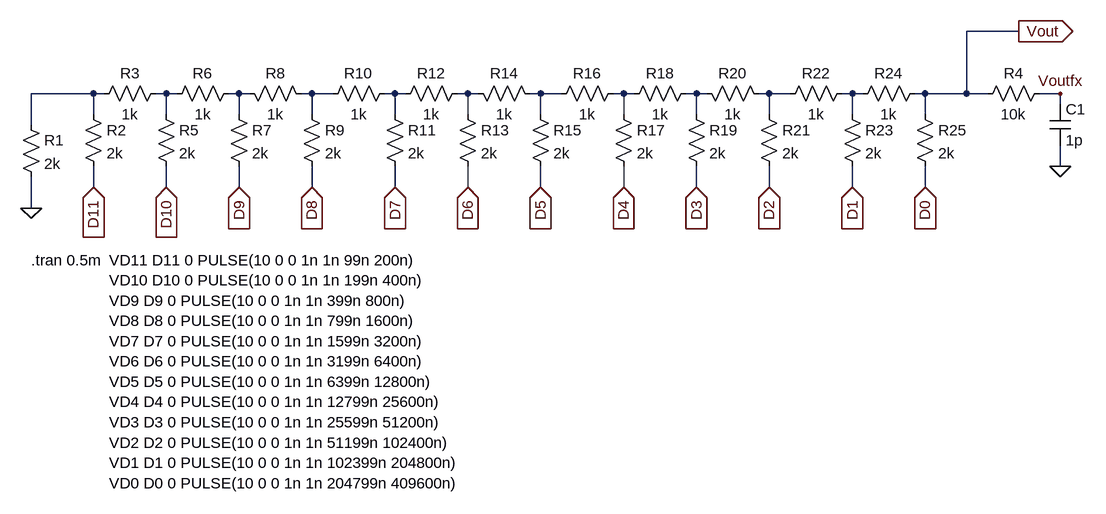
[diagram p0: schematic 12-bit-R2R.asc]
12-bit-R2R.asc, the LTspice schematic file:
Version 4
SHEET 1 1548 888
WIRE 1072 -176 992 -176
WIRE -352 -80 -448 -80
WIRE -336 -80 -352 -80
WIRE -240 -80 -256 -80
WIRE -224 -80 -240 -80
WIRE -128 -80 -144 -80
WIRE -112 -80 -128 -80
WIRE -16 -80 -32 -80
WIRE 16 -80 -16 -80
WIRE 112 -80 96 -80
WIRE 128 -80 112 -80
WIRE 224 -80 208 -80
WIRE 240 -80 224 -80
WIRE 336 -80 320 -80
WIRE 368 -80 336 -80
WIRE 464 -80 448 -80
WIRE 480 -80 464 -80
WIRE 576 -80 560 -80
WIRE 592 -80 576 -80
WIRE 688 -80 672 -80
WIRE 720 -80 688 -80
WIRE 816 -80 800 -80
WIRE 832 -80 816 -80
WIRE 928 -80 912 -80
WIRE 992 -80 992 -176
WIRE 992 -80 928 -80
WIRE 1024 -80 992 -80
WIRE 1136 -80 1104 -80
WIRE 1136 -64 1136 -80
WIRE -352 -48 -352 -80
WIRE -240 -48 -240 -80
WIRE -128 -48 -128 -80
WIRE -16 -48 -16 -80
WIRE 112 -48 112 -80
WIRE 224 -48 224 -80
WIRE 336 -48 336 -80
WIRE 464 -48 464 -80
WIRE 576 -48 576 -80
WIRE 688 -48 688 -80
WIRE 816 -48 816 -80
WIRE 928 -48 928 -80
WIRE -448 -32 -448 -80
WIRE 1136 32 1136 0
WIRE -352 64 -352 32
WIRE -240 64 -240 32
WIRE -128 64 -128 32
WIRE -16 64 -16 32
WIRE 112 64 112 32
WIRE 224 64 224 32
WIRE 336 64 336 32
WIRE 464 64 464 32
WIRE 576 64 576 32
WIRE 688 64 688 32
WIRE 816 64 816 32
WIRE 928 64 928 32
WIRE -448 96 -448 48
FLAG -448 96 0
FLAG 1136 32 0
FLAG 1136 -80 Voutfx
FLAG 1072 -176 Vout
IOPIN 1072 -176 Out
FLAG -352 64 D11
IOPIN -352 64 In
FLAG -240 64 D10
IOPIN -240 64 In
FLAG -128 64 D9
IOPIN -128 64 In
FLAG -16 64 D8
IOPIN -16 64 In
FLAG 112 64 D7
IOPIN 112 64 In
FLAG 224 64 D6
IOPIN 224 64 In
FLAG 336 64 D5
IOPIN 336 64 In
FLAG 464 64 D4
IOPIN 464 64 In
FLAG 576 64 D3
IOPIN 576 64 In
FLAG 688 64 D2
IOPIN 688 64 In
FLAG 816 64 D1
IOPIN 816 64 In
FLAG 928 64 D0
IOPIN 928 64 In
SYMBOL res -464 -48 R0
SYMATTR InstName R1
SYMATTR Value 2k
SYMBOL res -368 -64 R0
SYMATTR InstName R2
SYMATTR Value 2k
SYMBOL res -352 -64 R270
WINDOW 0 32 56 VTop 2
WINDOW 3 0 56 VBottom 2
SYMATTR InstName R3
SYMATTR Value 1k
SYMBOL res 1120 -96 R90
WINDOW 0 0 56 VBottom 2
WINDOW 3 32 56 VTop 2
SYMATTR InstName R4
SYMATTR Value 10k
SYMBOL cap 1120 -64 R0
SYMATTR InstName C1
SYMATTR Value 1p
SYMBOL res -256 -64 R0
SYMATTR InstName R5
SYMATTR Value 2k
SYMBOL res -240 -64 R270
WINDOW 0 32 56 VTop 2
WINDOW 3 0 56 VBottom 2
SYMATTR InstName R6
SYMATTR Value 1k
SYMBOL res -144 -64 R0
SYMATTR InstName R7
SYMATTR Value 2k
SYMBOL res -16 -64 M270
WINDOW 0 32 56 VTop 2
WINDOW 3 0 56 VBottom 2
SYMATTR InstName R8
SYMATTR Value 1k
SYMBOL res -32 -64 R0
SYMATTR InstName R9
SYMATTR Value 2k
SYMBOL res 0 -64 R270
WINDOW 0 32 56 VTop 2
WINDOW 3 0 56 VBottom 2
SYMATTR InstName R10
SYMATTR Value 1k
SYMBOL res 96 -64 R0
SYMATTR InstName R11
SYMATTR Value 2k
SYMBOL res 112 -64 R270
WINDOW 0 32 56 VTop 2
WINDOW 3 0 56 VBottom 2
SYMATTR InstName R12
SYMATTR Value 1k
SYMBOL res 208 -64 R0
SYMATTR InstName R13
SYMATTR Value 2k
SYMBOL res 336 -64 M270
WINDOW 0 32 56 VTop 2
WINDOW 3 0 56 VBottom 2
SYMATTR InstName R14
SYMATTR Value 1k
SYMBOL res 320 -64 R0
SYMATTR InstName R15
SYMATTR Value 2k
SYMBOL res 352 -64 R270
WINDOW 0 32 56 VTop 2
WINDOW 3 0 56 VBottom 2
SYMATTR InstName R16
SYMATTR Value 1k
SYMBOL res 448 -64 R0
SYMATTR InstName R17
SYMATTR Value 2k
SYMBOL res 464 -64 R270
WINDOW 0 32 56 VTop 2
WINDOW 3 0 56 VBottom 2
SYMATTR InstName R18
SYMATTR Value 1k
SYMBOL res 560 -64 R0
SYMATTR InstName R19
SYMATTR Value 2k
SYMBOL res 688 -64 M270
WINDOW 0 32 56 VTop 2
WINDOW 3 0 56 VBottom 2
SYMATTR InstName R20
SYMATTR Value 1k
SYMBOL res 672 -64 R0
SYMATTR InstName R21
SYMATTR Value 2k
SYMBOL res 704 -64 R270
WINDOW 0 32 56 VTop 2
WINDOW 3 0 56 VBottom 2
SYMATTR InstName R22
SYMATTR Value 1k
SYMBOL res 800 -64 R0
SYMATTR InstName R23
SYMATTR Value 2k
SYMBOL res 816 -64 R270
WINDOW 0 32 56 VTop 2
WINDOW 3 0 56 VBottom 2
SYMATTR InstName R24
SYMATTR Value 1k
SYMBOL res 912 -64 R0
SYMATTR InstName R25
SYMATTR Value 2k
TEXT -448 176 Left 2 !.tran 0.5m
TEXT -328 176 Left 2 !VD11 D11 0 PULSE(10 0 0 1n 1n 99n 200n)\nVD10 D10 0 PULSE(10 0 0 1n 1n 199n 400n)\nVD9 D9 0 PULSE(10 0 0 1n 1n 399n 800n)\nVD8 D8 0 PULSE(10 0 0 1n 1n 799n 1600n)\nVD7 D7 0 PULSE(10 0 0 1n 1n 1599n 3200n)\nVD6 D6 0 PULSE(10 0 0 1n 1n 3199n 6400n)\nVD5 D5 0 PULSE(10 0 0 1n 1n 6399n 12800n)\nVD4 D4 0 PULSE(10 0 0 1n 1n 12799n 25600n)\nVD3 D3 0 PULSE(10 0 0 1n 1n 25599n 51200n)\nVD2 D2 0 PULSE(10 0 0 1n 1n 51199n 102400n)\nVD1 D1 0 PULSE(10 0 0 1n 1n 102399n 204800n)\nVD0 D0 0 PULSE(10 0 0 1n 1n 204799n 409600n)

The netlist it stands for:
* 12-bit-R2R.asc
R1 N001 0 2k
R2 N001 D11 2k
R3 N001 N002 1k
R4 Voutfx Vout 10k
C1 Voutfx 0 1p
R5 N002 D10 2k
R6 N002 N003 1k
R7 N003 D9 2k
R8 N004 N003 1k
R9 N004 D8 2k
R10 N004 N005 1k
R11 N005 D7 2k
R12 N005 N006 1k
R13 N006 D6 2k
R14 N007 N006 1k
R15 N007 D5 2k
R16 N007 N008 1k
R17 N008 D4 2k
R18 N008 N009 1k
R19 N009 D3 2k
R20 N010 N009 1k
R21 N010 D2 2k
R22 N010 N011 1k
R23 N011 D1 2k
R24 N011 Vout 1k
R25 Vout D0 2k
.tran 0.5m
VD11 D11 0 PULSE(10 0 0 1n 1n 99n 200n)
VD10 D10 0 PULSE(10 0 0 1n 1n 199n 400n)
VD9 D9 0 PULSE(10 0 0 1n 1n 399n 800n)
VD8 D8 0 PULSE(10 0 0 1n 1n 799n 1600n)
VD7 D7 0 PULSE(10 0 0 1n 1n 1599n 3200n)
VD6 D6 0 PULSE(10 0 0 1n 1n 3199n 6400n)
VD5 D5 0 PULSE(10 0 0 1n 1n 6399n 12800n)
VD4 D4 0 PULSE(10 0 0 1n 1n 12799n 25600n)
VD3 D3 0 PULSE(10 0 0 1n 1n 25599n 51200n)
VD2 D2 0 PULSE(10 0 0 1n 1n 51199n 102400n)
VD1 D1 0 PULSE(10 0 0 1n 1n 102399n 204800n)
VD0 D0 0 PULSE(10 0 0 1n 1n 204799n 409600n)
.backanno
.end